# EAGLE schematic Voltmetro_3Digit_HADDAOUI (EAGLE 7.4.0)
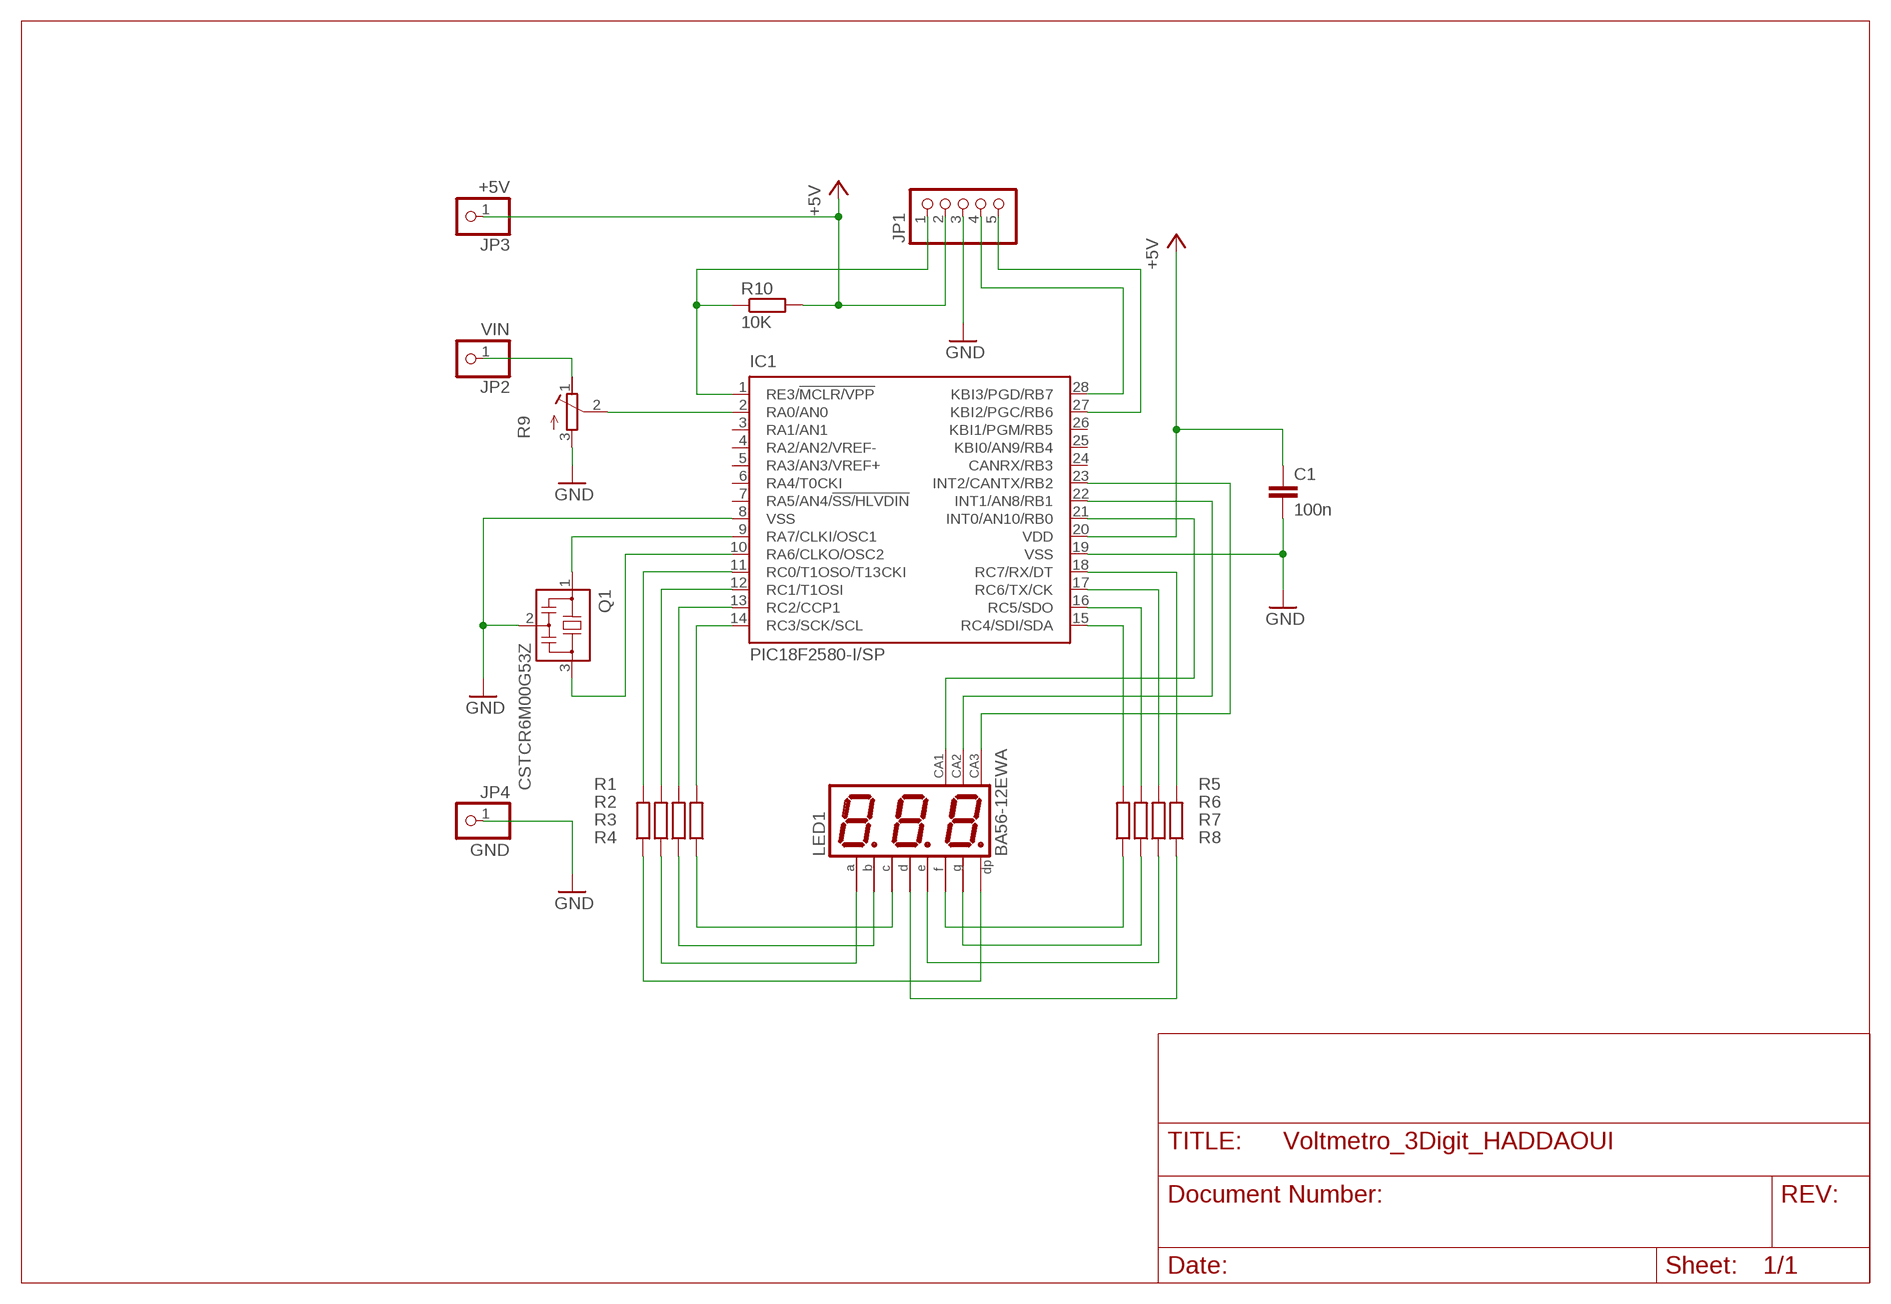
[diagram p0: schematic, sheet 1]

## Parts
C1  100n  C-EU025-025X050  [C025-025X050]
IC1  PIC18F2580-I/SP  [DIL28-3]
JP1  PINHD-1X5  [1X05]
JP2  VIN  PINHD-1X1  [1X01]
JP3  +5V  PINHD-1X1  [1X01]
JP4  GND  PINHD-1X1  [1X01]
LED1  BA56-12EWA  [BX56-12]
Q1  CSTCR6M00G53Z  [CSTCR6M]
R1  R-EU_0204/7  [0204/7]
R2  R-EU_0204/7  [0204/7]
R3  R-EU_0204/7  [0204/7]
R4  R-EU_0204/7  [0204/7]
R5  R-EU_0204/7  [0204/7]
R6  R-EU_0204/7  [0204/7]
R7  R-EU_0204/7  [0204/7]
R8  R-EU_0204/7  [0204/7]
R9  R-TRIMM43P  [RTRIM43P]
R10  10K  R-EU_0204/7  [0204/7]

## Nets
+5V: C1.1 IC1.20(VDD) JP1.2 JP3.1 R10.2
GND: C1.2 IC1.8(VSS) IC1.19(VSS) JP1.3 JP4.1 Q1.2 R9.3(A)
N$1: LED1.1(E) R7.1
N$2: IC1.1(RE3/!MCLR/VPP) JP1.1 R10.1
N$3: JP2.1 R9.1(E)
N$4: IC1.2(RA0/AN0) R9.2(S)
N$5: LED1.2(D) R8.1
N$6: IC1.9(RA7/CLKI/OSC1) Q1.1
N$7: IC1.10(RA6/CLKO/OSC2) Q1.3
N$8: LED1.4(C) R4.1
N$9: IC1.23(INT2/CANTX/RB2) LED1.8(CA)
N$10: IC1.22(INT1/AN8/RB1) LED1.9(CA)
N$11: IC1.21(INT0/AN10/RB0) LED1.12(CA)
N$12: IC1.18(RC7/RX/DT) R8.2
N$13: IC1.17(RC6/TX/CK) R7.2
N$14: IC1.16(RC5/SDO) R6.2
N$15: IC1.15(RC4/SDI/SDA) R5.2
N$16: LED1.10(F) R5.1
N$17: LED1.5(G) R6.1
N$18: LED1.7(B) R3.1
N$19: LED1.11(A) R2.1
N$20: LED1.3(DP) R1.1
N$21: IC1.14(RC3/SCK/SCL) R4.2
N$22: IC1.13(RC2/CCP1) R3.2
N$23: IC1.12(RC1/T1OSI) R2.2
N$24: IC1.11(RC0/T1OSO/T13CKI) R1.2
N$25: IC1.28(KBI3/PGD/RB7) JP1.4
N$26: IC1.27(KBI2/PGC/RB6) JP1.5
Unconnected: IC1.3(RA1/AN1) IC1.4(RA2/AN2/VREF-) IC1.5(RA3/AN3/VREF+) IC1.6(RA4/T0CKI) IC1.7(RA5/AN4/!SS/HLVDIN) IC1.24(CANRX/RB3) IC1.25(KBI0/AN9/RB4) IC1.26(KBI1/PGM/RB5)

## Library data of the parts
C1 = rcl:C-EU: CAPACITOR, European symbol
IC1 = microchip:PIC18F2*80: 28-Pin Enhanced Flash Microcontrollers with ECAN(TM) Technology 10-Bit A/D and nanoWatt Technology Source: http://www.microchip.com .. 39637a.pdf; MF: MICROCHIP; MPN: PIC18F2580-I/SP; OC_FARNELL: 9321276; OC_NEWARK: 71J7244
JP1 = pinhead:PINHD-1X5: PIN HEADER
JP2-JP4 = pinhead:PINHD-1X1: PIN HEADER
LED1 = display-kingbright:B?56-12*WA: 14.22mm (0.56INCH) THREE DIGIT NUMERIC DISPLAY Source: http://www.kingbright.com .. BA56-11EWA(Ver1189474895.pdf; OC_FARNELL: unknown; OC_NEWARK: unknown
Q1 = murata-filter:CSTCR: Resonator Source: murata.co.jp; MPN: CSTCR6M00G53-R0; OC_FARNELL: 1170434; OC_NEWARK: 25M8759
R1-R8 R10 = rcl:R-EU_: RESISTOR, European symbol
R9 = rcl:R-TRIMM: Trimm resistor